# EAGLE schematic HCGS-Noisy-Blinker (EAGLE 9.2.2)
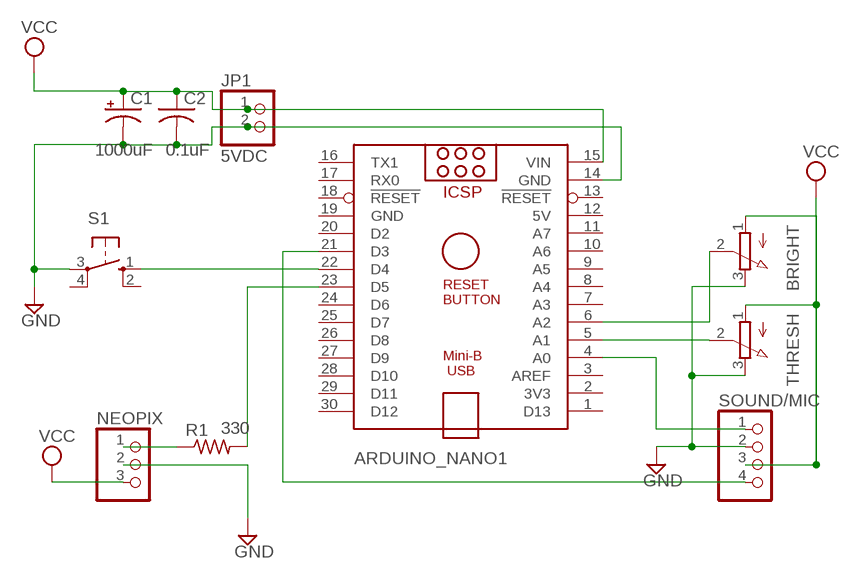
[diagram p0: schematic, sheet 1]

## Parts
ARDUINO_NANO1  ARDUINO_NANO_HCARDUINO_NANO_NO_HOLE  [ARDUINO_NANO_NO_HOLE]
BRIGHT  3RP/1610N  [3RP/1610N]
C1  1000uF  CPOL-USE5-10.5  [E5-10,5]
C2  0.1uF  C-US050-030X075  [C050-030X075]
JP1  5VDC  PINHD-1X2  [1X02]
NEOPIX  PINHD-1X3/90  [1X03/90]
R1  330  R-US_0309/12  [0309/12]
S1  40-XX  [B3F-40XX]
SOUND/MIC  PINHD-1X4  [1X04]
THRESH  3RP/1610N  [3RP/1610N]

## Nets
GND: ARDUINO_NANO1.14(GND) BRIGHT.3(E) C1.- C2.2 JP1.2 NEOPIX.2 S1.3(P) SOUND/MIC.2 THRESH.3(E)
N$1: ARDUINO_NANO1.4(A0) SOUND/MIC.1
N$2: NEOPIX.1 R1.1
N$3: ARDUINO_NANO1.21(D3) SOUND/MIC.4
N$4: ARDUINO_NANO1.22(D4) S1.1(S)
N$5: ARDUINO_NANO1.23(D5) R1.2
N$6: ARDUINO_NANO1.5(A1) THRESH.2(S)
N$7: ARDUINO_NANO1.6(A2) BRIGHT.2(S)
VCC: ARDUINO_NANO1.15(VIN) BRIGHT.1(A) C1.+ C2.1 JP1.1 NEOPIX.3 SOUND/MIC.3 THRESH.1(A)
Unconnected: ARDUINO_NANO1.1(D13) ARDUINO_NANO1.2(3V3) ARDUINO_NANO1.3(AREF) ARDUINO_NANO1.7(A3) ARDUINO_NANO1.8(A4) ARDUINO_NANO1.9(A5) ARDUINO_NANO1.10(A6) ARDUINO_NANO1.11(A7) ARDUINO_NANO1.13(!RESET) ARDUINO_NANO1.16(TX1) ARDUINO_NANO1.17(RX0) ARDUINO_NANO1.18(!RESET) ARDUINO_NANO1.20(D2) ARDUINO_NANO1.24(D6) ARDUINO_NANO1.25(D7) ARDUINO_NANO1.26(D8) ARDUINO_NANO1.27(D9) ARDUINO_NANO1.28(D10) ARDUINO_NANO1.29(D11) ARDUINO_NANO1.30(D12) S1.2(S1) S1.4(P1)

## Power pins joined to a net without a drawn wire
5V: ARDUINO_NANO1.12(5V)
GND: ARDUINO_NANO1.19(GND)

## Library data of the parts
ARDUINO_NANO1 = ArduinoNano_HC:ARDUINO_NANO_HC: Arduino Nano HC Overview: The Arduino Nano is a small, complete, and breadboard-friendly board based on the ATmega328 (Arduino Nano 3.x) or ATmega168 (Arduino Nano 2.x). It has more or less the same functionality of the Arduino Duemilanove, but in a different package. It lacks only a DC power jack, and works with a Mini-B USB cable instead of a standard one. The Nano was designed and is being produced by Gravitech. Specifications: Microcontroller Atmel ATmega168 or ATmega328 Operating Voltage (logic level) 5 V Input Voltage (recommended) 7-12 V Input Voltage (limits) 6-20 V Digital I/O Pins 14 (of which 6 provide PWM output) Analog Input Pins 8 DC Current per I/O Pin 40 mA Flash Memory 16 KB (ATmega168) or 32 KB (ATmega328) of which 2 KB used by bootloader SRAM 1 KB (ATmega168) or 2 KB (ATmega328) EEPROM 512 bytes (ATmega168) or 1 KB (ATmega328) Clock Speed 16 MHz Dimensions 0.73" x 1.70" Length 45 mm Width 18 mm Weigth 5 g Power: The Arduino Nano can be powered via the Mini-B USB connection, 6-20V unregulated external power supply (pin 30), or 5V regulated external power supply (pin 27). The power source is automatically selected to the highest voltage source. Memory: The ATmega168 has 16 KB of flash memory for storing code (of which 2 KB is used for the bootloader); the ATmega328 has 32 KB, (also with 2 KB used for the bootloader). The ATmega168 has 1 KB of SRAM and 512 bytes of EEPROM (which can be read and written with the EEPROM library); the ATmega328 has 2 KB of SRAM and 1 KB of EEPROM. Input and Output: Each of the 14 digital pins on the Nano can be used as an input or output, using pinMode(), digitalWrite(), and digitalRead() functions. They operate at 5 volts. Each pin can provide or receive a maximum of 40 mA and has an internal pull-up resistor (disconnected by default) of 20-50 kOhms. In addition, some pins have specialized functions. Visit Arduino - ArduinoBoardNano <https://www.arduino.cc/en/Main/ArduinoBoardNano>
BRIGHT THRESH = pot:3RP/1610N: 16mm Potentiometer one level Source: http://www.alphapotentiometers.net/html/16mm_pot_2.html
C1 = adafruit:CPOL-US: POLARIZED CAPACITOR, American symbol
C2 = adafruit:C-US: CAPACITOR, American symbol
JP1 = pinhead:PINHD-1X2: PIN HEADER
NEOPIX = pinhead:PINHD-1X3: PIN HEADER
R1 = adafruit:R-US_: RESISTOR, American symbol
S1 = adafruit:40-XX: OMRON SWITCH; MF: OMRON COMPONENTS USA; MPN: B3F-4000; OC_FARNELL: 176434; OC_NEWARK: 36K3105
SOUND/MIC = pinhead:PINHD-1X4: PIN HEADER